# Altium schematic sheet LSRO1AltiumTest.SchDoc: Init Title in DocParam
size A4; Organization: Use Organization_Name in ProjParam; Address1: Daniel Burnier; Address2: STI-MOBOTS; Address3: EPFL; Address4: CH-1015 LAUSANNE; DocumentNumber: Init DocumentNumber in DocParam; Revision: A; SheetNumber: 1; SheetTotal: 1; ApprovedBy: Init ApprovedBy in DocParam; CheckedBy: Init CheckedBy in DocParam; Author: Init Author in DocParam; CompanyName: Init CompanyName in DocParam; DrawnBy: Init DrawBy in DocParam; Engineer: Init Engineer in DocParam; Title2: Init Title2 in DocParam; DocumentName: Init DocumentName in DocParam; ProjectName: Init ProjectName in DocParam
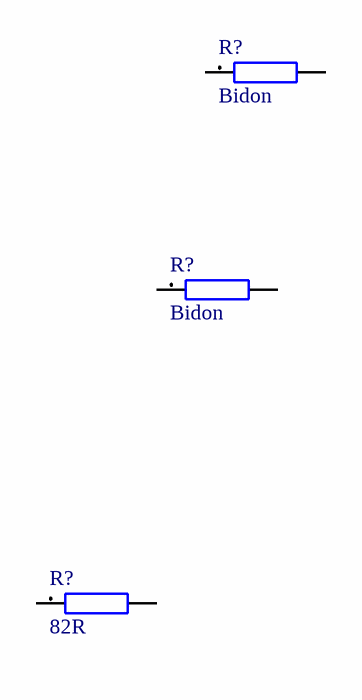
[diagram p0: LSRO1AltiumTest.SchDoc]

## Parts
(Parts that share a designator on the sheet are numbered #1, #2 ... from top to bottom, then left to right.)
R?#1  Bidon  [RESC1608X06L]
R?#2  Bidon  [RESC1608X06L]
R?#3  82R  [RESC1608X06L]

## Nets

Not connected (* = marked no-connect by the designer): R?#1 1 2; R?#2 1 2; R?#3 1 2

## Notes on the sheet
- Date:
- Project
- Part
- Revision:
- File :
- Page
- de

## Library data of the parts
R?#1 R?#2 = Bidon[[/\]]0603[[/\]]1: Resistor; Preference: 1; Quant_1: 0; Size: 0603; ROHS: False; Price_1: 0; Quant_2: 0; Price_2: 0; Quant_3: 0; Price_3: 0; Quant_4: 0; Price_4: 0; Quant_5: 0; Price_5: 0; Quant_6: 0; Price_6: 0; Supplier 1: Digi-Key
  R?#1: Supplier Part Number 1: P82.0HDKR-ND; Supplier 2: Digi-Key; Supplier Part Number 2: P82.0HTR-ND; Supplier 3: Mouser; Supplier Part Number 3: 667-ERJ-1GNF82R0C
  R?#2: Supplier Part Number 1: P374HDKR-ND
R?#3 = 82R[[/\]]0603[[/\]]2: Resistor; Manufacturer: Multicomp; Manufacturer Nr: MC 0.063W 0603 1% 82R; Tolerance: +/-1; Preference: 2; Power: 0.063; Voltage: 50; Current: 1; ppm/K: +/-200; Quant_2: 250; Quant_3: 1000; Quant_4: 5000; Quant_5: 15000; Currentie: CHF; Size: 0603; Footprint Acort: 0603; Supplier: Farnell; Supplier Nr: 9331590; ComponentLink2Description: Farnell link; ComponentLink2URL: http://ch.farnell.com/jsp/displayProduct.jsp?sku=9331590; ROHS: True; Quant_1: 50; Price_1: 0.066; Price_2: 0.052; Price_3: 0.041; Price_4: 0.03; Price_5: 0.022; DateLastUpdate: 2009-06-12 / 15:35:31; Supplier 1: Mouser; Supplier Part Number 1: 72-RTO020F82R00JTE3